# EAGLE design Voice Interaction Hat for MakePython v2.3 (EAGLE 6.1)
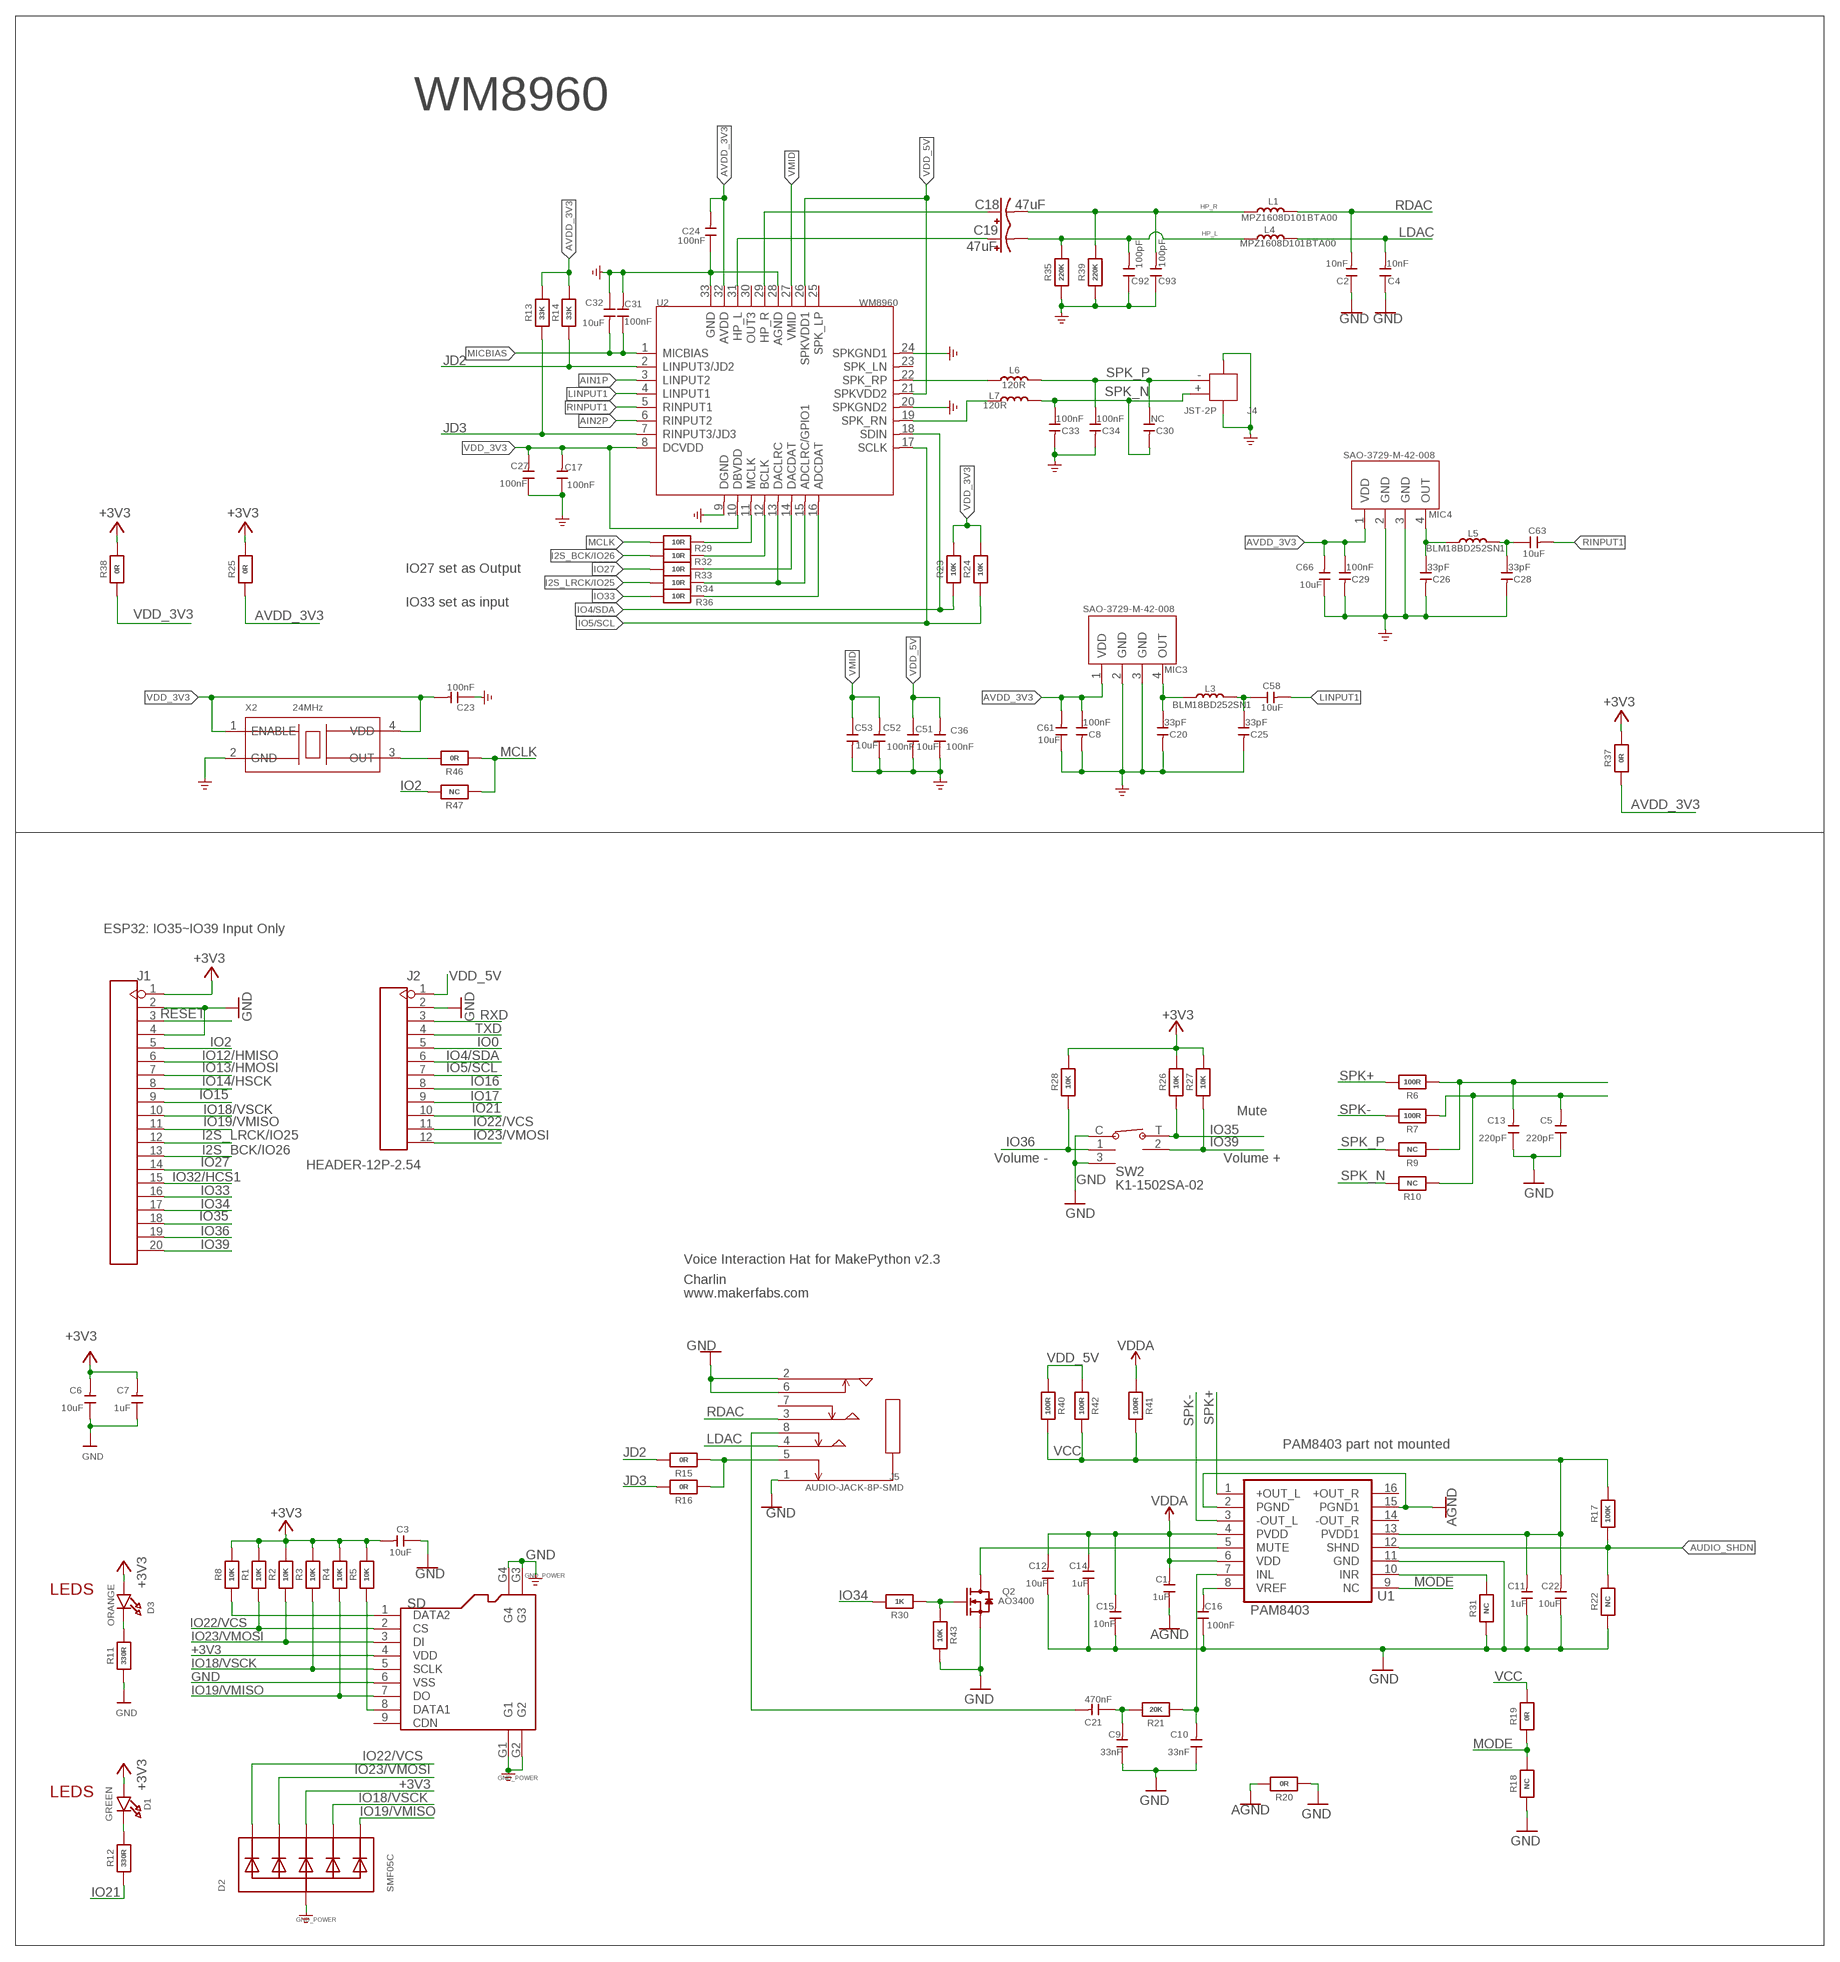
[diagram p0: schematic, sheet 1]

## Parts
C1  1uF  DISCRETE_C-0603  [DISCRETE_C0603]
C2  10nF  CAP-0402  [C0402]
C3  10uF  DISCRETE_C-0603  [DISCRETE_C0603]
C4  10nF  CAP-0402  [C0402]
C5  220pF  DISCRETE_C-0603  [DISCRETE_C0603]
C6  10uF  DISCRETE_C-0603  [DISCRETE_C0603]
C7  1uF  DISCRETE_C-0603  [DISCRETE_C0603]
C8  100nF  CAP-0603  [C0603]
C9  33nF  DISCRETE_C-0603  [DISCRETE_C0603]
C10  33nF  DISCRETE_C-0603  [DISCRETE_C0603]
C11  1uF  DISCRETE_C-0603  [DISCRETE_C0603]
C12  10uF  DISCRETE_C-0603  [DISCRETE_C0603]
C13  220pF  DISCRETE_C-0603  [DISCRETE_C0603]
C14  1uF  DISCRETE_C-0603  [DISCRETE_C0603]
C15  10nF  DISCRETE_C-0603  [DISCRETE_C0603]
C16  100nF  DISCRETE_C-0603  [DISCRETE_C0603]
C17  100nF  CAP-0402  [C0402]
C18  47uF  47UF-POLAR-EIA3528-10V-10%  [EIA3528]
C19  47uF  47UF-POLAR-EIA3528-10V-10%  [EIA3528]
C20  33pF  CAP-0603  [C0603]
C21  470nF  DISCRETE_C-0603  [DISCRETE_C0603]
C22  10uF  DISCRETE_C-0603  [DISCRETE_C0603]
C23  100nF  CAP-0402  [C0402]
C24  100nF  CAP-0402  [C0402]
C25  33pF  CAP-0603  [C0603]
C26  33pF  CAP-0603  [C0603]
C27  100nF  CAP-0402  [C0402]
C28  33pF  CAP-0603  [C0603]
C29  100nF  CAP-0603  [C0603]
C30  NC  CAP-0603  [C0603]
C31  100nF  CAP-0402  [C0402]
C32  10uF  CAP-0603  [C0603]
C33  100nF  CAP-0603  [C0603]
C34  100nF  CAP-0603  [C0603]
C36  100nF  CAP-0402  [C0402]
C51  10uF  CAP-0603  [C0603]
C52  100nF  CAP-0402  [C0402]
C53  10uF  CAP-0603  [C0603]
C58  10uF  CAP-0603  [C0603]
C61  10uF  CAP-0603  [C0603]
C63  10uF  CAP-0603  [C0603]
C66  10uF  CAP-0603  [C0603]
C92  100pF  CAP-0402  [C0402]
C93  100pF  CAP-0402  [C0402]
D1  GREEN  LED0805_NOOUTLINE  [CHIPLED_0805_NOOUTLINE]
D2  SMF05C  TVSARRAY_5LANE  [SOT363]
D3  ORANGE  LED0805_NOOUTLINE  [CHIPLED_0805_NOOUTLINE]
J1  HEADER-20P-2.54  [20P-2.54]
J2  HEADER-12P-2.54  [12P-2.54]
J4  JST-2P  JST-2P-SMD'2.0'  [HW2-SMD-2.0-90D]
J5  AUDIO-JACK-8P-SMD  AUDIO-JACK-8P-SMD'PJ-393'  [AUDIO8P-SMD-3.5-14.5X6.1X4.0MM]
L1  MPZ1608D101BTA00  INDUCTOR/FERRITE-BEAD'0603'  [L0603]
L3  BLM18BD252SN1  INDUCTOR/FERRITE-BEAD'0603'  [L0603]
L4  MPZ1608D101BTA00  INDUCTOR/FERRITE-BEAD'0603'  [L0603]
L5  BLM18BD252SN1  INDUCTOR/FERRITE-BEAD'0603'  [L0603]
L6  120R  INDUCTOR/FERRITE-BEAD'0603'  [L0603]
L7  120R  INDUCTOR/FERRITE-BEAD'0603'  [L0603]
MIC3  SAO-3729-M-42-008  MIC-MSM421A3729H8-C  [MIC4-SMD-3.76X2.95MM]
MIC4  SAO-3729-M-42-008  MIC-MSM421A3729H8-C  [MIC4-SMD-3.76X2.95MM]
Q2  AO3400  MOSFET-N'SOT23'  [SOT23@1]
R1  10K  RESISTOR_0603_NOOUT  [0603-NO]
R2  10K  RESISTOR_0603_NOOUT  [0603-NO]
R3  10K  RESISTOR_0603_NOOUT  [0603-NO]
R4  10K  RESISTOR_0603_NOOUT  [0603-NO]
R5  10K  RESISTOR_0603_NOOUT  [0603-NO]
R6  100R  RESISTOR_0603_NOOUT  [0603-NO]
R7  100R  RESISTOR_0603_NOOUT  [0603-NO]
R8  10K  RESISTOR_0603_NOOUT  [0603-NO]
R9  NC  RESISTOR_0603_NOOUT  [0603-NO]
R10  NC  RESISTOR_0603_NOOUT  [0603-NO]
R11  330R  RESISTOR_0603_NOOUT  [0603-NO]
R12  330R  RESISTOR_0603_NOOUT  [0603-NO]
R13  33K  RESISTOR_0603_NOOUT  [0603-NO]
R14  33K  RESISTOR_0603_NOOUT  [0603-NO]
R15  0R  RESISTOR_0603_NOOUT  [0603-NO]
R16  0R  RESISTOR_0603_NOOUT  [0603-NO]
R17  100K  RESISTOR_0603_NOOUT  [0603-NO]
R18  NC  RESISTOR_0603_NOOUT  [0603-NO]
R19  0R  RESISTOR_0603_NOOUT  [0603-NO]
R20  0R  RESISTOR_0603_NOOUT  [0603-NO]
R21  20K  RESISTOR_0603_NOOUT  [0603-NO]
R22  NC  RESISTOR_0603_NOOUT  [0603-NO]
R23  10K  RESISTOR_0603_NOOUT  [0603-NO]
R24  10K  RESISTOR_0603_NOOUT  [0603-NO]
R25  0R  RESISTOR_0603_NOOUT  [0603-NO]
R26  10K  RESISTOR_0603_NOOUT  [0603-NO]
R27  10K  RESISTOR_0603_NOOUT  [0603-NO]
R28  10K  RESISTOR_0603_NOOUT  [0603-NO]
R29  10R  RESISTOR_0603_NOOUT  [0603-NO]
R30  1K  RESISTOR_0603_NOOUT  [0603-NO]
R31  NC  RESISTOR_0603_NOOUT  [0603-NO]
R32  10R  RESISTOR_0603_NOOUT  [0603-NO]
R33  10R  RESISTOR_0603_NOOUT  [0603-NO]
R34  10R  RESISTOR_0603_NOOUT  [0603-NO]
R35  220K  RESISTOR_0603_NOOUT  [0603-NO]
R36  10R  RESISTOR_0603_NOOUT  [0603-NO]
R37  0R  RESISTOR_0603_NOOUT  [0603-NO]
R38  0R  RESISTOR_0603_NOOUT  [0603-NO]
R39  220K  RESISTOR_0603_NOOUT  [0603-NO]
R40  100R  RESISTOR_0603_NOOUT  [0603-NO]
R41  100R  RESISTOR_0603_NOOUT  [0603-NO]
R42  100R  RESISTOR_0603_NOOUT  [0603-NO]
R43  10K  RESISTOR_0603_NOOUT  [0603-NO]
R46  0R  RESISTOR_0603_NOOUT  [0603-NO]
R47  NC  RESISTOR_0603_NOOUT  [0603-NO]
SD  HOLDER-MICROSD-9P  [9P-SMD-W/-RING]
SW2  K1-1502SA-02  [SMD5-60P-1180L1170W]
U1  PAM8403  [SOP-16]
U2  WM8960  AMPLIFIER-WM8960  [QFN32G-0.5-5X5MM]
X2  24MHz  CRYSTAL-OSCILLATOR2.5*2.0  [OSC4-SMD-2.5X2.0X0.8MM]

## Nets
$123: C18.A(+) U2.29(HP_R)
$124: C19.A(+) U2.31(HP_L)
+3V3: C3.2 C6.2 C7.2 D1.A D2.4(C3) D3.A J1.1 R1.2 R2.2 R3.2 R4.2 R5.2 R8.2 R25.2 R26.2 R27.2 R28.2 R37.2 R38.2 SD.4(VDD)
AGND: C1.1 R20.2 U1.2(PGND) U1.15(PGND1)
AIN1P: U2.3(LINPUT2)
AIN2P: U2.6(RINPUT2)
AUDIO_SHDN: R17.1 R22.2 U1.12(SHND)
AVDD_3V3: C8.1 C24.2 C29.1 C61.2 C66.2 MIC3.1(VDD) MIC4.1(VDD) R13.2 R14.2 R25.1 R37.1 U2.32(AVDD)
GND: C2.1 C3.1 C4.1 C5.1 C6.1 C7.1 C8.2 C9.1 C10.1 C11.1 C12.1 C13.1 C14.1 C15.1 C16.1 C17.1 C20.2 C22.1 C23.1 C24.1 C25.2 C26.2 C27.1 C28.2 C29.2 C31.2 C32.1 C33.2 C34.2 C36.1 C51.2 C52.1 C53.2 C61.1 C66.1 C92.1 C93.1 D2.2(A) J1.2 J1.4 J2.2 J4.3 J4.4 J5.1 J5.2 J5.6 MIC3.2(GND) MIC3.3(GND) MIC4.2(GND) MIC4.3(GND) Q2.2(S) R11.1 R18.1 R20.1 R22.1 R31.1 R35.1 R39.1 R43.2 SD.6(VSS) SD.G1 SD.G2 SD.G3 SD.G4 SW2.3 SW2.C U1.11(GND) U2.9(DGND) U2.20(SPKGND2) U2.24(SPKGND1) U2.28(AGND) U2.33(GND) X2.2(GND) ; supply symbol labelled GND_POWER
HP_L: C19.C(-) C92.2 L4.1 R35.2
HP_R: C18.C(-) C93.2 L1.1 R39.2
I2S_BCK/IO26: J1.13 R32.2
I2S_LRCK/IO25: J1.12 R34.2
IO0: J2.5
IO2: J1.5 R47.2
IO4/SDA: J2.6 R23.1 U2.18(SDIN)
IO5/SCL: J2.7 R24.1 U2.17(SCLK)
IO12/HMISO: J1.6
IO13/HMOSI: J1.7
IO14/HSCK: J1.8
IO15: J1.9
IO16: J2.8
IO17: J2.9
IO18/VSCK: D2.5(C4) J1.10 R3.1 SD.5(SCLK)
IO19/VMISO: D2.6(C5) J1.11 R4.1 SD.7(DO)
IO21: J2.10 R12.1
IO22/VCS: D2.1(C1) J2.11 R1.1 SD.2(CS)
IO23/VMOSI: D2.3(C2) J2.12 R2.1 SD.3(DI)
IO27: J1.14 R33.2
IO32/HCS1: J1.15
IO33: J1.16 R36.2
IO34: J1.17 R30.2
IO35: J1.18 R26.1 SW2.T
IO36: J1.19 R28.1 SW2.1
IO39: J1.20 R27.1 SW2.2
JD2: R14.1 R15.2 U2.2(LINPUT3/JD2)
JD3: R13.1 R16.2 U2.7(RINPUT3/JD3)
LDAC: C4.2 J5.4 L4.2
LINPUT1: C58.2 U2.4(LINPUT1)
MCLK: R29.2 R46.1 R47.1
MICBIAS: C31.1 C32.2 U2.1(MICBIAS)
MODE: R18.2 R19.1 U1.9(NC)
N$1: R8.1 SD.1(DATA2)
N$2: R5.1 SD.8(DATA1)
N$3: D1.C R12.2
N$4: C10.2 R21.1 U1.7(INL)
N$5: D3.C R11.2
N$6: C13.2 R6.1 R9.1
N$7: C9.2 C21.1 R21.2
N$8: Q2.1(G) R30.1 R43.1
N$9: J5.5 R15.1 R16.1
N$10: R33.1 U2.14(DACDAT)
N$11: Q2.3(D) U1.5(MUTE)
N$12: C25.1 C58.1 L3.2
N$13: C20.1 L3.1 MIC3.4(OUT)
N$14: C5.2 R7.1 R10.1
N$15: C28.1 C63.1 L5.2
N$16: C16.2 U1.8(VREF)
N$17: R46.2 X2.3(OUT)
N$18: R31.2 U1.10(INR)
N$30: C26.1 L5.1 MIC4.4(OUT)
N$34: R36.1 U2.16(ADCDAT)
N$35: R34.1 U2.13(DACLRC) U2.15(ADCLRC/GPIO1)
N$36: R32.1 U2.12(BCLK)
N$37: R29.1 U2.11(MCLK)
N$42: L6.1 U2.22(SPK_RP)
N$45: L7.1 U2.19(SPK_RN)
N$62: C21.2 J5.8
RDAC: C2.2 J5.3 L1.2
RESET: J1.3
RINPUT1: C63.2 U2.5(RINPUT1)
RXD: J2.3
SPK+ [3V3]: R6.2 U1.1(+OUT_L)
SPK- [3V3]: R7.2 U1.3(-OUT_L)
SPK_N: C30.2 C33.1 J4.+ L7.2 R10.2
SPK_P: C30.1 C34.1 J4.- L6.2 R9.2
TXD: J2.4
VCC: C11.2 C22.2 R17.2 R19.2 R40.2 R41.2 R42.2 U1.13(PVDD1)
VDD_3V3: C17.2 C23.2 C27.2 R23.2 R24.2 R38.1 U2.8(DCVDD) U2.10(DBVDD) X2.1(ENABLE) X2.4(VDD)
VDD_5V: C36.2 C51.1 J2.1 R40.1 R42.1 U2.21(SPKVDD2) U2.26(SPKVDD1)
VDDA: C1.2 C12.2 C14.2 C15.2 R41.1 U1.4(PVDD) U1.6(VDD)
VMID: C52.2 C53.1 U2.27(VMID)
Unconnected: J5.7 SD.9(CDN) U1.14(-OUT_R) U1.16(+OUT_R) U2.23(SPK_LN) U2.25(SPK_LP) U2.30(OUT3)

## Notes on the sheet
- WM8960
- IO27 set as Output
- IO33 set as input
- ESP32: IO35~IO39 Input Only
- Mute
- Volume - | Volume +
- Voice Interaction Hat for MakePython v2.3
- Charlin
- www.makerfabs.com
- PAM8403 part not mounted
- LEDS
- LEDS

## Library data of the parts
C1 C3 C5-C7 C9-C16 C21 C22 = A9G:DISCRETE_C*: Ceramic Capacitors
C2 C4 C8 C17 C20 C23-C34 C36 C51-C53 C58 C61 C63 C66 C92 C93 = Discrete-new:CAP: Ceramic Capacitors
C18 C19 = SparkFun-Capacitors:47UF-POLAR: 47µF polarized capacitors A capacitor is a passive two-terminal electrical component used to store electrical energy temporarily in an electric field.; PROD_ID: CAP-08310
D1 D3 = microbuilder:LED: LED 0603 - 0603 Surface Mount Package 2mA: Green LED - Low Power (3.9mcd, 2ma, 1.7Vf) - Digikey: 475-2709-2-ND Orange LED - Low Power (9.8mcd, 2ma, 1.8Vf) - Digikey: 475-1194-2-ND Red LED - Low Power (5mcd, 2ma, 1.8Vf) - Digikey: 475-1195-2-ND Yellow LED - Low Power (7mcd, 2ma, 1.8Vf) - Digikey: 475-1196-2-ND 5mA: Blue LED - Low Power (17mcd, 5ma, 2.9Vf) - Digikey: LNJ937W8CRACT-ND 0805 - 0805 Surface Mount Package 2mA: Red LED (8.8mcd, 2mA, 1.8Vf, Clear) - Low Power [Digikey: 475-2510-1-ND] Green LED (5mcd, 2mA, 1.8Vf, Clear) - Low Power [Digikey: 475-2730-1-ND] Yellow LED (11.3mcd, 2mA, 1.8Vf, Clear) - Low Power [Digikey: 475-2555-1-ND] 20mA: Red LED (104mcd, 20mA, Diffused) - LS R976 [Digikey: 475-1278-6-ND] Red LED (12mcd, 20mA, 2.0Vf, Clear) - APT2012EC [Digikey: 754-1128-1-ND] Green LED (15mcd, 20mA, 2.2Vf, Clear) - APT2012GC [Digikey: 754-1131-1-ND] Orange LED (160mcd, 20mA, 2.1Vf, Clear) - APT2012SECK [Digikey: 754-1130-1-ND] 1206 - 1206 Surface Mount Package Green LED (26mcd, 20mA, Diffused) - LG N971 [Digikey: 475-1407-6-ND] Red LED (15mcd, 20mA, Diffused) - LH N974 [Digikey: 475-1416-6-ND] Cree - Cree High-Power Surface Mount LEDs XPEBWT-L1-0000-00D50 - White 111lm 350mA 2.9Vf 6200K 110° XTEAWT-00-0000-00000LEE3 - White 114lm 350mA 2.85Vf 5000K 115° Everlight - Everlight 45-21 Series Surface Mount LEDs 45-21/QK2C-B2832AC2CB2/2T - Warm White 2000mcd 20mA 3.25Vf 3050K 120° 45-21/LK2C-B38452C4CB2/2T - Nuetral White 2000mcd 20mA 3.25Vf 4150K 120° 45-21/LK2C-B50634C6CB2/2T - Cold White 2200mcd 20mA 3.25Vf 5650K 120° PLCC2 Reverse Mount LS T77K-J1L2-1-0-2-R18-Z - Red 11.25mcd 2mA 1.8Vf 630nm 120° LO T77K-L1M2-24-Z - Orange 19.6mcd 2mA 1.8Vf 606nm 120° LY T77K-K2M1-26-Z - Yellow 15.7mcd 2mA 1.8Vf 587nm 120°
D2 = microbuilder:TVSARRAY_5LANE: Voltage Transient Suppressor Array SOT363 SMF05C - 100W 5V: Digikey - SMF05CT1GOSCT-ND
J1 = Connector:HEADER-20P
J2 = Connector:HEADER-12P
J4 = Connector-new:JST-2P-SMD: 2P-SMD-1.0-90D:320110054;2P-SMD-2.0-90D:320110026
J5 = Connector-new:AUDIO-JACK-8P-SMD: 320040009
L1 L3-L7 = Discrete-new:INDUCTOR/FERRITE-BEAD
MIC3 MIC4 = Connector-new:MIC-MSM421A3729H8-C
Q2 = Discrete:MOSFET-N: IRLL014: http://www.vishay.com/docs/91319/sihll014.pdf
R1-R43 R46 R47 = microbuilder:RESISTOR: Resistors For new designs, use the packages preceded by an '_' character since they are more reliable: The following footprints should be used on most boards: _0402 - Standard footprint for regular board layouts _0603 - Standard footprint for regular board layouts _0805 - Standard footprint for regular board layouts _1206 - Standard footprint for regular board layouts For extremely tight-pitch boards where space is at a premium, the following 'micro-pitch' footprints can be used (smaller pads, no silkscreen outline, etc.): _0402MP - Micro-pitch footprint for very dense/compact boards _0603MP - Micro-pitch footprint for very dense/compact boards _0805MP - Micro-pitch footprint for very dense/compact boards _1206MP - Micro-pitch footprint for very dense/compact boards
SD = Connector:HOLDER-MICROSD-9P
SW2 = self:K1-1502SA-02
U1 = PAM8403:PAM8403: Dual channel audio amplifier IC - PAM8403
U2 = IC-new:AMPLIFIER-WM8960
X2 = Discrete-new:CRYSTAL-OSCILLATOR

## Net classes
0 default: width 0.203 mm, drill 0.305 mm, clearance 0.152 mm
2 3V3: width 0.305 mm
3 usbvcc: width 0.508 mm, drill 0.61 mm, clearance 0.254 mm

## Board
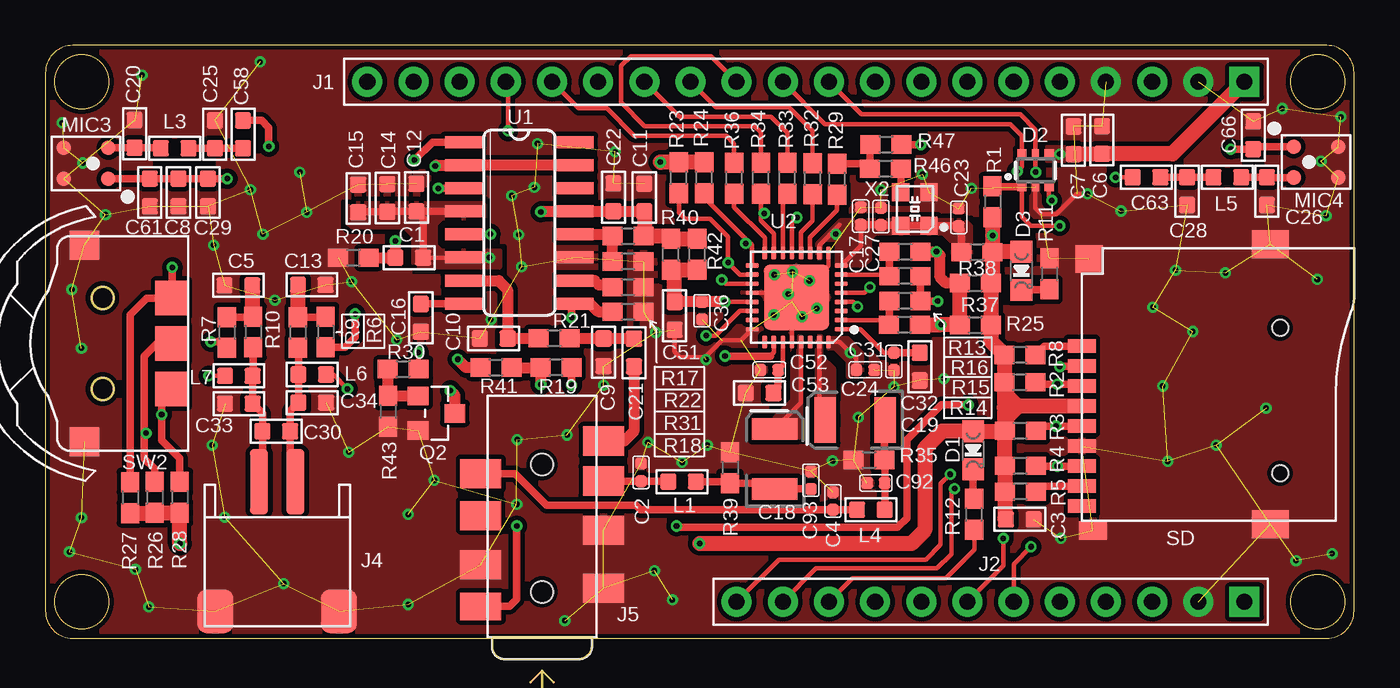
[diagram p1: board, top side]
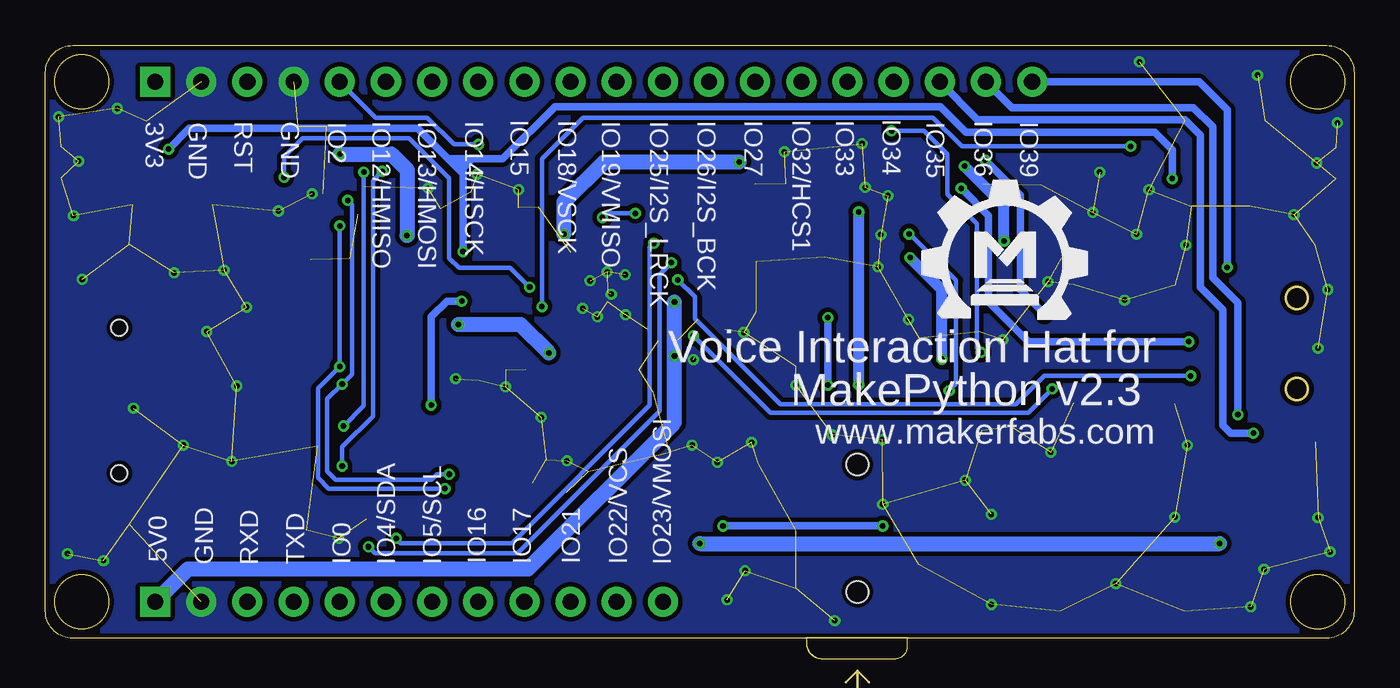
[diagram p2: board, bottom side, seen from below]

Size 72 x 32.6 mm. Coordinates in mm from the lower left corner, seen from the top.
Outline: 1.5,0 70.5,0 arc90 72,1.5 72,31.1 arc90 70.5,32.6 1.5,32.6 arc90 0,31.1 0,1.5 arc90 1.5,0
Outline: circle at 70,2 radius 1.5
Outline: circle at 70,30.6 radius 1.5
Outline: circle at 2,2 radius 1.5
Outline: circle at 2,30.6 radius 1.5
Copper layers (1*16): Top 0.035mm / dielectric 1.5mm / Bottom 0.035mm
Design rules: minimum track width 6mil, minimum drill 10mil, track to track 6mil, track to pad 6mil, pad to pad 6mil, via to via 6mil, smd to smd 0mil, copper to edge 10mil, drill to drill 10mil, minimum pad ring 10mil, minimum via ring 6mil, stop-mask expansion 2mil, vias tented up to drill 100mil, thermal gap 0mil

### Footprints (pad centres in the part's own frame; a part is rotated, then mirrored left to right if it is on the bottom)
DISCRETE_C0603 = smd 0.889 x 0.889: 1 -0.762,0; 2 0.762,0
C0402 = smd 0.635 x 0.635: 1 0,0.484; 2 0,-0.484
C0603 = smd 0.889 x 0.889: 1 0,0.762; 2 0,-0.762
EIA3528 = smd 1.2 x 2.5: A 1.65,0; C -1.65,0
CHIPLED_0805_NOOUTLINE = smd 1.2 x 1.2: A 0,-1.05; C 0,1.05
SOT363 = smd 0.5 x 0.5: 1 -0.75,-0.9; 3 0.75,-0.9; 4 0.75,0.9; 6 -0.75,0.9 | smd 0.4 x 0.5: 2 0,-0.9; 5 0,0.9
20P-2.54 = drill 0.889 pad 1.651 square: 1 -25.4,0 | drill 0.889 pad 1.651: 2 -22.86,0; 3 -20.32,0; 4 -17.78,0; 5 -15.24,0; 6 -12.7,0; 7 -10.16,0; 8 -7.62,0; 9 -5.08,0; 10 -2.54,0; 11 0,0; 12 2.54,0; 13 5.08,0; 14 7.62,0; 15 10.16,0; 16 12.7,0; 17 15.24,0; 18 17.78,0; 19 20.32,0; 20 22.86,0
12P-2.54 = drill 0.889 pad 1.651 square: 1 0,13.97 | drill 0.889 pad 1.651: 2 0,11.43; 3 0,8.89; 4 0,6.35; 5 0,3.81; 6 0,1.27; 7 0,-1.27; 8 0,-3.81; 9 0,-6.35; 10 0,-8.89; 11 0,-11.43; 12 0,-13.97
HW2-SMD-2.0-90D = smd 2 x 2.4: 3 3.4,-2.181; 4 -3.4,-2.181 | smd 1 x 3.6: + -1,4.953; - 1,4.953
AUDIO8P-SMD-3.5-14.5X6.1X4.0MM = smd 1.6 x 2.25: 1 3.9,-3.375; 2 7.1,-3.375; 3 9.8,-3.375; 4 10.2,3.375; 6 5.2,3.375; 7 7.9,3.375; 8 12,-3.375 | smd 1.5 x 2.25: 5 2.9,3.375 | hole 1.2: 3.7,0; 10.7,0
L0603 = smd 0.889 x 0.889: 1 -0.762,0; 2 0.762,0
MIC4-SMD-3.76X2.95MM = smd 0.8 x 0.8: 1 0.85,1.23; 2 0.85,-1.23; 3 -0.85,-1.23; 4 -0.85,1.23
SOT23@1 = smd 1.016 x 1.143: 1 -0.95,-1.016; 2 0.95,-1.016; 3 0,1.016
0603-NO = smd 1.1 x 1: 1 -0.85,0; 2 0.85,0
9P-SMD-W/-RING = smd 1.524 x 0.762: 1 0,4.4; 2 0,3.3; 3 0,2.2; 4 0,1.1; 5 0,0; 6 0,-1.1; 7 0,-2.2; 8 0,-3.3; 9 0,-4.4 | smd 1.524 x 1.016: G1 0.6,-5.746 | smd 2.032 x 1.524: G2 10.373,-5.4; G3 10.373,10 | smd 1.524 x 1.524: G4 0.392,9.181 | hole 0.889: 10.9,-2.6; 10.9,5.4
SMD5-60P-1180L1170W = smd 1.9 x 1.8: 1 -2.5,0; 2 2.5,0; T 0,0 | smd 1.6 x 1.6: 3 -5.4,4.8; C 5.4,4.8
SOP-16 = smd 0.66 x 2.032: 1 -4.445,-3.073; 2 -3.175,-3.073; 3 -1.905,-3.073; 4 -0.635,-3.073; 5 0.635,-3.073; 6 1.905,-3.073; 7 3.175,-3.073; 8 4.445,-3.073; 9 4.445,3.073; 10 3.175,3.073; 11 1.905,3.073; 12 0.635,3.073; 13 -0.635,3.073; 14 -1.905,3.073; 15 -3.175,3.073; 16 -4.445,3.073
QFN32G-0.5-5X5MM = smd 0.7 x 0.25: 1 -2.45,1.75; 2 -2.45,1.25; 3 -2.45,0.75; 4 -2.45,0.25; 5 -2.45,-0.25; 6 -2.45,-0.75; 7 -2.45,-1.25; 8 -2.45,-1.75; 17 2.45,-1.75; 18 2.45,-1.25; 19 2.45,-0.75; 20 2.45,-0.25; 21 2.45,0.25; 22 2.45,0.75; 23 2.45,1.25; 24 2.45,1.75 | smd 0.25 x 0.7: 9 -1.75,-2.45; 10 -1.25,-2.45; 11 -0.75,-2.45; 12 -0.25,-2.45; 13 0.25,-2.45; 14 0.75,-2.45; 15 1.25,-2.45; 16 1.75,-2.45; 25 1.75,2.45; 26 1.25,2.45; 27 0.75,2.45; 28 0.25,2.45; 29 -0.25,2.45; 30 -0.75,2.45; 31 -1.25,2.45; 32 -1.75,2.45 | smd 3.6 x 3.6: 33 0,0
OSC4-SMD-2.5X2.0X0.8MM = smd 1 x 0.95: 1 -0.925,-0.775; 2 0.925,-0.775; 3 0.925,0.775; 4 -0.925,0.775

### Placement (x,y rotation side)
C1  20.02,20.93 0 top
C2  32.77,9.12 0 top
C3  53.61,6.53 180 top
C4  43.33,7.54 0 top
C5  10.62,19.41 0 top
C6  58.13,27.4 270 top
C7  56.56,27.38 270 top
C8  7.32,24.51 0 top
C9  30.71,15.72 90 top
C10  24.66,16.48 0 top
C11  32.95,24.24 270 top
C12  20.41,24.23 270 top
C13  14.66,19.43 180 top
C14  18.81,24.21 270 top
C15  17.2,24.18 270 top
C16  20.65,17.62 90 top
C17  44.86,23.22 0 top
C18  40.13,9.86 90 top
C19  44.55,11.99 180 top
C20  4.9,27.74 180 top
C21  32.38,15.71 270 top
C22  31.25,24.25 270 top
C23  50.25,23.14 0 top
C24  45.11,14.76 270 top
C25  9.32,27.71 180 top
C26  67.21,24.59 0 top
C27  45.97,23.19 0 top
C28  62.81,24.59 0 top
C29  8.94,24.51 0 top
C30  12.7,11.38 270 top
C31  46.69,15.21 0 top
C32  48.11,14.94 180 top
C33  10.64,12.9 270 top
C34  14.68,12.95 90 top
C36  36.12,18.01 180 top
C51  34.62,17.73 0 top
C52  39.83,14.76 90 top
C53  39.29,13.49 270 top
C58  10.87,27.71 180 top
C61  5.74,24.51 180 top
C63  60.58,25.35 270 top
C66  66.45,27.66 0 top
C92  45.69,8.53 90 top
C93  42.11,8.69 0 top
D1  51.04,10.34 180 top
D2  54.47,25.73 0 top
D3  53.7,20.2 180 top
J1  40.57,30.6 180 top
J2  52,2 270 top
J4  12.75,3.65 0 top
J5  27.32,-1.16 90 top
L1  35.03,8.61 180 top
L3  7.11,26.95 0 top
L4  45.42,7.06 180 top
L5  65.02,25.35 180 top
L6  14.68,14.5 180 top
L7  10.64,14.43 0 top
MIC3  2.24,26.11 270 top
MIC4  69.9,26.19 90 top
Q2  21.51,12.37 270 top
R1  52.1,24 270 top
R2  53.6,14.07 180 top
R3  53.64,11.4 180 top
R4  53.64,9.48 180 top
R5  53.64,8.06 180 top
R6  15.42,16.84 270 top
R7  9.98,16.81 270 top
R8  53.62,15.58 180 top
R9  13.89,16.81 270 top
R10  11.43,16.84 270 top
R11  55.23,20.04 270 top
R12  51.1,6.81 90 top
R13  47.29,21.26 0 top
R14  47.27,17.25 0 top
R15  47.29,18.54 180 top
R16  47.29,19.91 180 top
R17  32.05,22.12 0 top
R18  32.05,17.96 180 top
R19  28.09,14.88 180 top
R20  16.94,20.93 0 top
R21  27.99,16.5 0 top
R22  32.05,20.71 180 top
R23  34.85,25.32 90 top
R24  36.25,25.32 90 top
R25  51.16,17.22 0 top
R26  6.01,7.75 270 top
R27  4.66,7.73 270 top
R28  7.39,7.75 270 top
R29  43.56,25.25 90 top
R30  19.68,14.81 0 top
R31  32.05,19.3 180 top
R32  42.21,25.27 90 top
R33  40.82,25.3 90 top
R34  39.37,25.3 90 top
R35  45.31,9.8 0 top
R36  37.9,25.3 90 top
R37  51.16,19.53 0 top
R38  51.26,21.23 0 top
R39  37.67,9.37 270 top
R40  34.42,21.11 90 top
R41  24.79,14.88 0 top
R42  35.86,21.11 90 top
R43  18.85,12.47 270 top
R46  46.22,25.82 0 top
R47  46.25,27.15 0 top
SD  57.03,11.67 0 top
SW2  6.95,16.21 90 top
U1  26.07,22.84 270 top
U2  41.33,18.75 180 top
U$1  [MAKERFABS_0.3]  23.32,17.58 0 bottom
X2  47.84,23.61 90 top

### Tracks (layer width: path | path; a pad name or v marks a point on that pad's centre or on a via)
$123
  Top 0.254: U2.29 41.58,12.95 C18.A
  pour Top: 41.43,16.59 41.43,15.52 41.1,15.19 41.1,13.08 39.98,11.96 39.98,11.05 41.58,11.05 41.58,16.59
$124
  Top 0.254: U2.31 42.58,12.31 C19.A
  pour Top: 42.44,16.61 42.44,10.87 43.38,10.87 43.38,14.81 42.67,15.52 42.67,16.61
+3V3  (via drill 0.3)
  Top 0.254: C7.2 55.23,26.62 D2.4 55.23,26.62 v55.8,26.62 | R1.2
  Top 0.61: 52.76,13.64 53.59,12.8 53.72,12.8 | 54.18,12.8 53.72,12.8 | 53.72,12.8 52.88,11.96
  Top 0.813: v35.99,5.21 47.65,5.21 48.39,5.94 48.39,10.44 49.34,11.39 D1.A 52.77,11.39 | v7.39,5.21 R28.2 | R27.2 5.99,6.88 R26.2 R28.2 | C7.2 58.11,26.62 C6.2 62.01,26.64 J1.1 | R38.2 v52.11,22.15 R1.2 | R38.2 52.11,19.63 R37.2 R25.2 52.01,16.34 R8.2 52.77,14.09 R2.2 | D3.A 52.12,21.25 R38.2 | R2.2 52.76,12.68 | 52.76,12.68 52.76,11.44 R3.2 52.77,11.39 | SD.4 52.85,12.77 52.76,12.68 | 52.77,11.39 52.77,9.5 R4.2 R5.2 52.79,6.59 C3.2 | 52.76,13.64 R2.2
  Top 1.016: R28.2
  Bottom 0.813: v55.8,26.62 52.96,26.62 52.09,25.76 52.09,22.16 v52.11,22.15 | v35.99,5.21 v7.39,5.21
  pour Top: 57.02,27 55.09,27 55.09,26.26 57.02,26.26
AGND  (via drill 0.3)
  Top 0.61: U1.15 U1.2 21.5,26.02 v21.44,25.96 | R20.2 C1.1 v19.25,21.84
  Bottom 0.61: v19.25,21.84 19.25,23.77 v21.44,25.96
AUDIO_SHDN
  Top 0.61: U1.12 31.12,22.21 R17.1 R22.2
AVDD_3V3  (via drill 0.3)
  Top 0.254: U2.32 43.7,16.3 v44.3,15.7 44.63,15.37 C24.2
  Top 0.406: MIC3.1 C61.2 C8.1 C29.1 v10.01,25.27 | 50.28,17.25 R25.1 | MIC4.1 66.58,27.04 C66.2 v65.23,26.9
  Top 0.61: R13.2 v49.02,21.26 49.23,21.06 49.23,19.86 49.55,19.53 R37.1
  Top 0.813: R14.2 v49.28,17.25 50.28,17.25 | R25.1 R37.1
  Bottom 0.406: 48.51,26.36 46.84,26.36 43.97,29.23 22.76,29.23 21.36,27.84 10.97,27.84 10.01,26.87 v10.01,25.27 | 49.02,26.36 49.53,26.36 | 49.84,26.36 51.51,28.04 64.08,28.04 v65.23,26.9 | v49.02,21.26 49.02,25.55 | 49.02,25.55 49.02,25.86 | 49.02,25.86 49.02,26.36 | 49.02,25.86 48.51,26.36 | 48.51,26.36 49.02,26.36 | 49.84,26.36 49.53,26.36 | 49.53,26.36 49.02,25.86 | 49.84,26.36 49.02,25.55
  Bottom 0.813: v44.3,15.7 45.85,17.25 v49.28,17.25
  pour Top: 43.08,15.95 43.43,15.95 44.15,15.24 44.15,14.38 44.93,14.38 44.93,15.67 44.12,16.48 43.08,16.48
GND  (via drill 0.3)  (144 unrouted)
  Top 0.254: U2.28 41.08,18.5 U2.33 | U2.20 41.08,19 U2.33 | U2.9 43.08,20.5 U2.33 | U2.24 38.26,16.38 37.24,16.38 36.3,15.44 34.92,15.44 34.62,15.75 C51.2 | D2.2 54.47,23.63 54.79,23.32 55.63,23.32 56.74,24.43 v57.33,24.43
  other vias: 70.46,23.24 62.18,20.24 71.27,28.68 70.79,4.65 68.81,4.27 69.98,19.74 45.97,24.66 48.26,25.53 40.11,19.99 42.04,19.66 42.44,18.14 40.08,17.78 40.87,18.92 41.63,17.68 41.1,20.14 50.95,24.74 64.41,10.62 11.28,24.66 9.25,21.62 1.98,15.95 1.45,19.18 3.3,23.29 1.98,6.63 4.95,3.78 5.69,1.73 1.32,4.75 13.11,3 19.96,1.85 19.96,6.81 16.69,10.24 9.17,10.62 9.86,6.65 25.96,10.92 33.15,10.77 34.49,2.11 28.57,0.97 25.93,7.37 21.39,8.69 33.58,16.81 43.31,9.75 49.43,14.27 55.88,5.49 61.75,9.73 63.12,16.87 67.16,12.65 61.47,13.87 59.18,23.5 64.92,20.09 60.93,18.21 25.65,24.33 26.04,22.2 26.9,24.79 31.34,26.75 14.38,23.42 19.33,16.41 16.84,19.61 28.7,11.18 36.35,15.32 27.08,27.2 26.19,20.42 24.51,17.53 35.03,9.68 36.42,10.62 11.96,22.23 14,25.63 12.62,18.59 30.71,13.92 5.31,30.96 11.81,31.7 2.06,26.14 0.91,28.35 68.05,29.13 70.18,26.24 44.73,12.14 46.69,13.82 33.5,3.71
  pour Bottom (isolate 0.254, rank 6): -7.62,35 76.2,35 76.2,-5.08 -7.62,-5.08
  pour Top (isolate 0.254, rank 6): -7.62,35 76.2,35 76.2,-5.08 -7.62,-5.08
HP_L
  Top 0.406: L4.1 C92.2 46.18,9.79 R35.2 46.16,11.95 C19.C
HP_R
  Top 0.406: L1.1 37.58,8.61 R39.2 39.81,8.52 C18.C C93.2
I2S_BCK/IO26
  Top 0.254: J1.13 36.88,29.21 40.92,29.21 42.22,27.91 R32.2
I2S_LRCK/IO25
  Top 0.254: J1.12 36.63,32 32.21,32 31.67,31.47 31.67,29.46 32.97,28.17 39.01,28.17 39.37,27.81 R34.2
IO2  (via drill 0.3)
  Top 0.254: 48.08,27.15 v48.16,27.15
  Top 0.406: R47.2 48.08,27.15
  Bottom 0.254: J1.5 53.84,28.63 51,28.63 49.53,27.15 v48.16,27.15
IO4/SDA  (via drill 0.3)
  Top 0.254: J2.6 53.27,4.07 v54.23,5.03 | R23.1 34.85,23.39 35.18,23.06 36.58,23.06 37.57,22.07 v37.57,20.65 38.23,19.99 U2.18
  Bottom 0.254: v54.23,5.03 53.87,4.67 46.02,4.67 38.23,12.47 38.23,19.99 v37.57,20.65
IO5/SCL  (via drill 0.3)
  Top 0.254: R24.1 36.25,24.26 38.66,21.84 | 38.66,21.84 38.88,21.63 U2.17 | J2.7 52.7,3.98 v52.7,5.49 | v38.53,21.72 38.66,21.84
  Bottom 0.254: v52.7,5.49 52.45,5.23 46.33,5.23 38.76,12.8 38.76,21.49 v38.53,21.72
IO18/VSCK  (via drill 0.3)
  Top 0.254: J1.10 44.91,28.8 53.65,28.8 54.47,27.98 D2.5 v54.47,25.64 v54.48,25.63
  Top 0.406: SD.5 v55.6,11.67 54.75,11.67 R3.1
  Bottom 0.254: v54.48,25.63 54.48,12.79 v55.6,11.67
IO19/VMISO  (via drill 0.3)
  Top 0.254: J1.11 42.9,28.27 53.09,28.27 53.72,27.63 D2.6 53.72,25.93 v53.47,25.68
  Top 0.406: SD.7 v55.68,9.47 R4.1
  Bottom 0.254: v55.68,9.47 55.68,10.52 53.98,12.22 53.98,25.17 v53.47,25.68
IO21
  Top 0.254: J2.10 44.41,3.3 49.53,3.3 51.1,4.87 R12.1
IO22/VCS  (via drill 0.3)
  Top 0.254: 52.13,24.83 R1.1 | J2.11 42.41,3.83 49.05,3.83 49.84,4.62 49.84,8.05 v50.01,8.23 | 57.05,14.99 SD.2 | D2.1 53.72,23.19 54.23,22.68 v55.8,22.68
  Top 0.406: v55.8,14.94 55.84,14.97 SD.2 | 52.13,24.83 D2.1
  Bottom 0.254: v50.01,8.23 56.41,8.23 57,8.81 57,13.74 v55.8,14.94 v55.8,22.68
IO23/VMOSI  (via drill 0.3)
  Top 0.254: J2.12 40.35,4.32 48.44,4.32 49.25,5.13 49.25,8.48 v49.78,9.02 | D2.3 55.22,24.23 v55.37,24.08
  Top 0.406: R2.1 54.56,13.97 v55.68,13.97 56.93,13.97 SD.3
  Bottom 0.254: v49.78,9.02 50.44,9.02 50.75,8.71 56.03,8.71 56.49,9.17 56.49,13.16 v55.68,13.97 55.12,14.53 55.12,23.82 v55.37,24.08
IO27
  Top 0.254: J1.14 34.87,28.68 39.93,28.68 40.82,27.79 R33.2
IO33
  Top 0.254: J1.16 29.34,29.13 30.89,29.13 32.38,27.64 37.47,27.64 37.9,27.2 R36.2
IO34  (via drill 0.3)
  Top 0.254: R30.2 20.54,15.71 v20.52,15.72 | J1.17 25.45,30.48 v25.45,27.9
  Bottom 0.254: v20.52,15.72 20.75,15.95 20.75,22.8 22.38,24.43 22.38,26.62 23.66,27.9 v25.45,27.9
IO35  (via drill 0.3)
  Top 0.406: R26.1 6.01,9.31 5.44,9.88 5.44,11.25 | 5.44,11.25 5.44,15.52 6.12,16.2 SW2.T | v5.54,11.28 5.46,11.28 5.44,11.25
  Bottom 0.406: J1.18 20.71,28.52 9.32,28.52 8.46,27.66 8.46,19.3 7.21,18.06 7.21,11.71 6.78,11.28 v5.54,11.28
IO36  (via drill 0.3)
  Top 0.406: SW2.1 6.4,13.16 v6.4,12.29 6.4,10.9 7.39,9.91 R28.1
  Bottom 0.406: J1.19 18.84,29.18 8.84,29.18 7.77,28.12 7.77,19.84 6.4,18.46 v6.4,12.29
IO39  (via drill 0.3)
  Top 0.406: R27.1 4.66,17.79 5.56,18.69 6.93,18.69 SW2.2 6.99,18.75 v6.99,20.4
  Bottom 0.406: J1.20 8.53,30.6 6.99,29.06 v6.99,20.4
JD2
  Top 0.254: U2.2 46.17,17.5 R14.1
  Top 0.406: R15.2 46.45,17.27 R14.1
JD3
  Top 0.254: U2.7 46.36,20 R16.2
  Top 0.406: R16.2 R13.1
LDAC
  Top 0.406: L4.2 C4.2 32.74,7.06 32.49,7.32 27.56,7.32 25.83,9.04 J5.4
LINPUT1  (via drill 0.3)
  Top 0.254: U2.4 44.42,18.5 v44.68,18.24
  Top 0.406: C58.2 11.89,28.47 12.29,28.07 v12.29,27.05
  Bottom 0.254: v44.68,18.24 44.68,26.36 42.42,28.63 23.16,28.63 21.59,27.05 v12.29,27.05
MCLK
  Top 0.406: R47.1 45.37,27.12 R46.1 45.09,26.1 R29.2
MICBIAS
  Top 0.254: U2.1 44.83,17 46.13,15.7 C31.1
  Top 0.406: C31.1 C32.2
MODE  (via drill 0.3)
  Top 0.406: R19.1 28.94,13.93 v28.96,13.92 | v28.96,17.63 28.96,18.21 U1.9
  Top 0.61: U1.9 29.96,18.4 30.4,17.96 R18.2
  Bottom 0.406: v28.96,13.92 v28.96,17.63
N$1
  Top 0.406: SD.1 54.96,16.07 R8.1
N$2
  Top 0.406: SD.8 54.8,8.37 R5.1
N$3
  Top 0.406: R12.2 51.04,7.72 D1.C
N$4
  Top 0.61: U1.7 24.93,19.67 25.43,19.18 C10.2 27.13,16.48 R21.1
N$5
  Top 0.406: D3.C 55.2,19.15 R11.2
N$6
  Top 0.406: R9.1 15.39,17.66 R6.1
  Top 0.813: R9.1 C13.2
N$7
  Top 0.61: R21.2 30.7,16.5 C9.2 32.37,16.48 C21.1
N$8
  Top 0.61: R30.1 18.85,14.8 R43.1 Q2.1
N$9  (via drill 0.3)
  Top 0.406: R16.1 R15.1 | J5.5 25.54,1.74 25.93,2.13 v25.93,6.17 | v50.77,12.83 49.3,12.83 47.4,10.92 47.4,6.6 46.89,6.1 34.8,6.1 v34.72,6.17 | v49.1,18.54 R15.1 | 48.11,18.54 R15.1
  Bottom 0.406: v50.77,12.83 50.77,17.68 49.91,18.54 v49.1,18.54 | v25.93,6.17 v34.72,6.17
N$10
  Top 0.254: U2.14 40.58,24.21 R33.1
N$11  (via drill 0.3)
  Top 0.254: v24.49,22.23 24.47,22.21 U1.5
  Top 0.61: Q2.3 22.53,13.36 v22.28,13.61
  Bottom 0.254: v22.28,13.61 21.89,13.99 21.89,19.68 24.43,22.23 v24.49,22.23
N$12
  Top 0.406: L3.2 C25.1 C58.1
N$13
  Top 0.406: MIC3.4 C20.1 6.33,26.98 L3.1
N$14
  Top 0.406: R7.1 11.4,17.66 R10.1
  Top 0.813: C5.2 11.38,17.74 R10.1
N$15
  Top 0.406: L5.2 C28.1 C63.1
N$16
  Top 0.406: U1.8 20.68,18.4 C16.2
N$17
  Top 0.406: X2.3 R46.2
N$18
  Top 0.61: U1.10 30.22,19.67 30.45,19.43 31.08,19.43 R31.2
N$30
  Top 0.406: MIC4.4 67.22,25.34 C26.1 L5.1
N$34
  Top 0.254: U2.16 39.58,22.02 37.9,23.7 R36.1
N$35  (via drill 0.3)
  Top 0.254: U2.15 40.08,22.26 39.37,22.96 39.37,23.32 | 39.37,23.32 R34.1 | U2.13 41.08,22.86 v41.35,23.14 | v39.55,23.37 39.42,23.37 39.37,23.32
  Bottom 0.254: v39.55,23.37 41.12,23.37 v41.35,23.14
N$36
  Top 0.254: U2.12 41.58,22.32 42.22,22.96 R32.1
N$37
  Top 0.254: U2.11 42.08,22.06 43.56,23.55 R29.1
N$42  (via drill 0.3)
  Top 0.254: U2.22 38.21,18 36.85,16.64 v36.35,16.64 | v16.61,13.72 15.82,14.5 L6.1
  Bottom 0.254: v36.35,16.64 32.11,12.39 17.93,12.39 v16.61,13.72
N$45  (via drill 0.3)
  Top 0.254: U2.19 37.43,19.5 v37.21,19.71 | v8.99,14.43 L7.1
  Bottom 0.254: v37.21,19.71 36.27,18.77 36.27,17.58 31.57,12.88 18.59,12.88 17.04,14.43 v8.99,14.43
N$62
  Top 0.61: C21.2 32.38,11.38 31.85,10.85 J5.8
RDAC
  Top 0.406: J5.3 32.76,8.64 C2.2 34.24,8.63 L1.2
RINPUT1  (via drill 0.3)
  Top 0.254: C63.2 v58.88,25.35 | U2.5 45.06,19 v45.36,19.3
  Bottom 0.254: v58.88,25.35 58.88,26.47 57.84,27.51 51.99,27.51 49.78,25.3 49.78,20.9 49.25,20.37 46.43,20.37 v45.36,19.3
SPK+  (via drill 0.3)
  Top 0.406: v17.04,17.83 17.04,16.56 16.48,16 15.43,16 R6.2 | U1.1 21.3,27.29 v20.3,26.29
  Bottom 0.406: v17.04,17.83 18.36,19.15 18.36,24.36 v20.3,26.29
SPK-  (via drill 0.3)
  Top 0.406: U1.3 v21.62,24.75 v21.61,24.74 | v9.09,16.31 9.64,16.31 R7.2
  Bottom 0.406: v21.61,24.74 20.12,23.24 20.12,18.49 17.93,16.31 v9.09,16.31
SPK_N
  Top 0.203: 11.94,8.9 11.75,8.71 J4.+
  Top 0.406: 11.94,8.9 C30.2 11.94,12.37 C33.1 L7.2 11.43,14.45 R10.2
SPK_P
  Top 0.203: 13.46,9 13.75,8.71 J4.-
  Top 0.406: 13.46,9 C30.1 13.46,12.5 C34.1 L6.2 13.92,15.94 R9.2
VCC  (via drill 0.3)
  Top 0.61: v27.25,13.95 27.24,13.96 R19.2 R41.2 | v27.25,23.44 27.29,23.48 U1.13 31.24,23.48 C22.2 32.93,23.49 C11.2
  Top 0.813: R42.2 R40.2 34.25,22.12 R17.2 32.95,22.17 C11.2
  Bottom 0.61: v27.25,13.95 v27.25,23.44
VDD_3V3  (via drill 0.3)
  Top 0.254: U2.8 44.86,21.58 C17.2 | U2.10 42.58,21.62 43.69,22.73
  Top 0.406: R38.1 50.41,22.5 C23.2 50.23,22.68 X2.1 X2.4 47.04,22.71 C27.2 45.95,22.73 C17.2
  Top 0.813: R24.2 R23.2 33.85,26.17 v33.83,26.19
  Bottom 0.813: v33.83,26.19 41.27,26.19 43.48,23.98 v43.48,22.22
  pour Top: 42.44,20.9 42.44,21.67 43.76,22.99 50.6,22.99 50.93,22.66 50.93,20.78 49.94,20.78 49.94,21.74 49.4,22.28 45.67,22.28 45.36,21.97 45.36,20.85 45.01,20.5 43.54,20.5 43.54,21.82 43.43,21.92 42.88,21.92 42.65,21.69 42.65,20.9
VDD_5V  (via drill 0.3)
  Top 0.254: U2.21 C36.2 | U2.26 40.08,15.72 39.88,15.52
  Top 0.406: 39.88,15.52 v37.39,15.52
  Top 0.61: C36.2 C51.1 | v37.39,18.49 C36.2
  Top 0.813: R42.1 R40.1 34.62,20.05 C51.1
  Bottom 0.813: J2.1 64.16,3.81 45.44,3.81 37.39,11.86 v37.39,15.52 37.39,16.61 v37.39,18.49
VDDA  (via drill 0.3)
  Top 0.254: U1.6 22.89,20.93 C1.2
  Top 0.406: U1.4 C12.2 | C12.2 20.78,23.11 C1.2 | C12.2 18.84,23.48 C14.2 17.23,23.45 C15.2
  Top 0.61: v24.43,20.93 22.89,20.93 | R41.1 23.14,14.88 v22.68,15.34
  Bottom 0.61: v22.68,15.34 22.68,19.18 v24.43,20.93
  pour Top: 24.99,20.4 20.47,20.4 20.27,20.6 20.27,22.1 19.76,22.61 16.87,22.61 16.64,22.83 16.64,23.75 16.81,23.93 24.03,23.93 24.13,23.83 24.13,23.19 24.03,23.09 21.79,23.09 21.46,22.76 21.46,21.62 21.77,21.31 25.02,21.31 25.02,20.42
VMID
  Top 0.254: U2.27 40.58,15.02 C52.2
  Top 0.406: C52.2 40.31,13.74 C53.1

### Text on the board
bPlace: IO34 | IO33 | IO32/HCS1 | IO18/VSCK | IO15 | IO39 | IO36 | IO35 | IO27 | IO26/I2S_BCK | IO25/I2S_LRCK | IO19/VMISO | IO14/HSCK | IO13/HMOSI | IO12/HMISO | IO2 | GND | RST | GND | 3V3 | Voice Interaction Hat for | MakePython v2.3 | www.makerfabs.com | IO23/VMOSI | IO22/VCS | IO21 | IO17 | IO16 | IO5/SCL | IO4/SDA | IO0 | TXD | RXD | GND | 5V0